# Altium schematic sheet 6_power.SchDoc: Power management
size A4; OrganizationName: Pluton UPV; Address1: Universitat Politècnica; Address2: de València (UPV); Address3: Camí de Vera, València; Address4: Spain; DocumentNumber: 3; Revision: 0; SheetNumber: 6; SheetTotal: 8
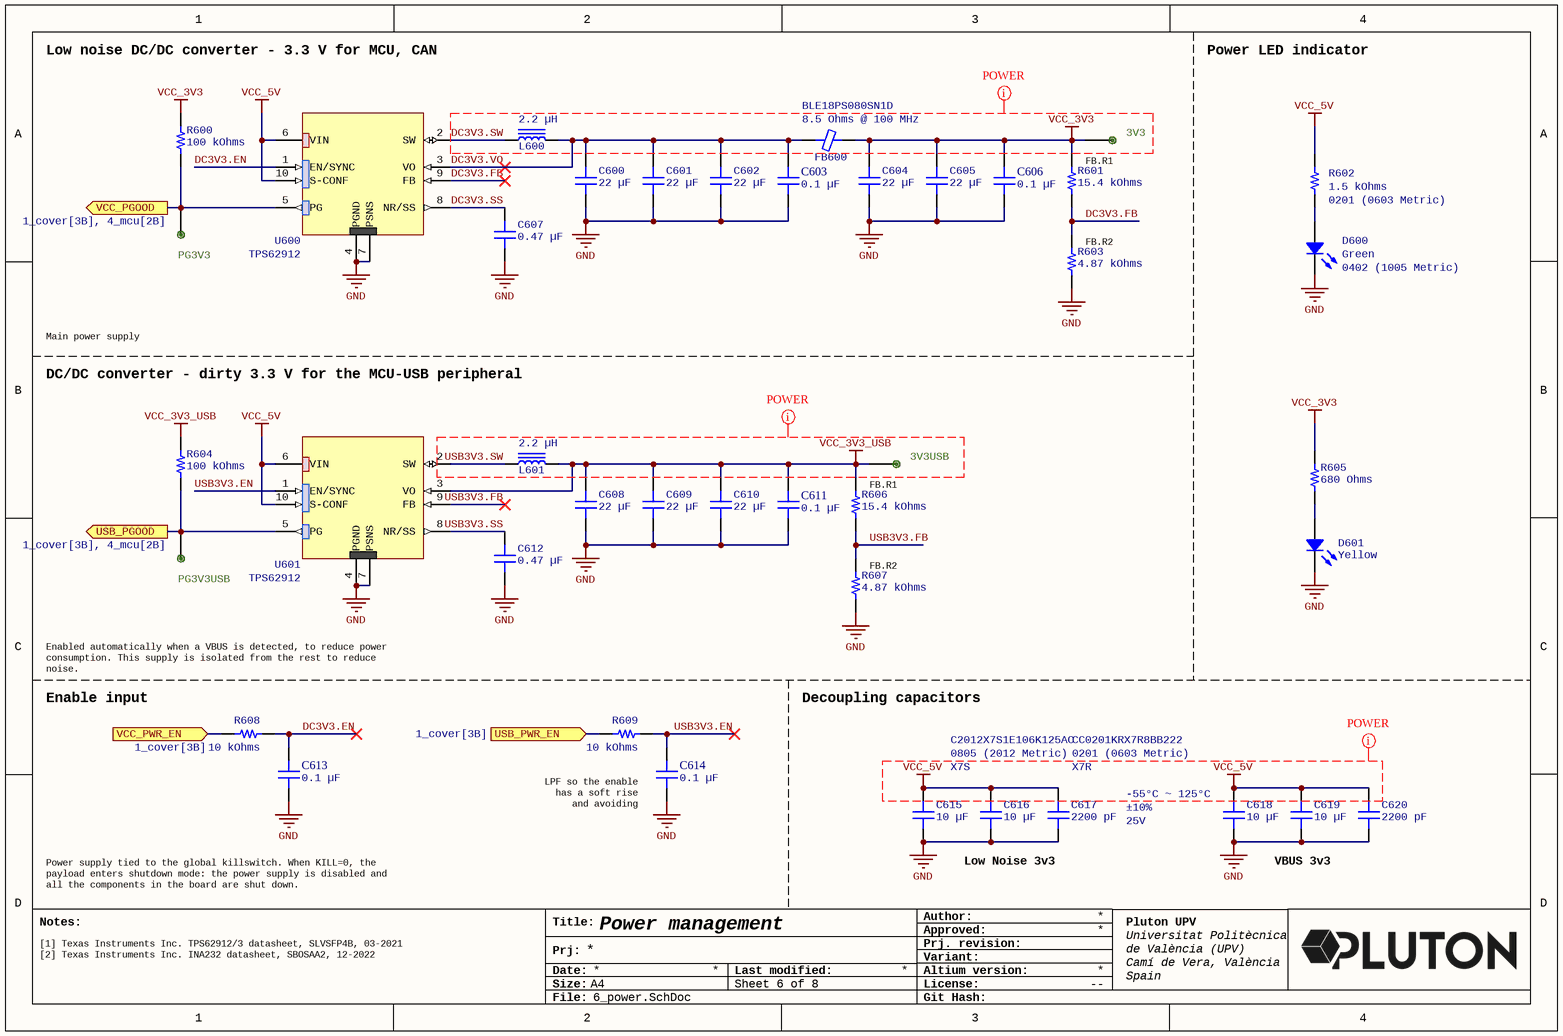
[diagram p0: 6_power.SchDoc]

## Parts
3V3  (no value)  [testpoint_via]  (no BOM)
3V3USB  (no value)  [testpoint_via]  (no BOM)
C600  22 µF  [CAP 0805_2012]
C601  22 µF  [CAP 0805_2012]
C602  22 µF  [CAP 0805_2012]
C603  0.1 µF  [CAP 0402_1005]
C604  22 µF  [CAP 0805_2012]
C605  22 µF  [CAP 0805_2012]
C606  0.1 µF  [CAP 0402_1005]
C607  0.47 µF  [CAP 0402_1005]
C608  22 µF  [CAP 0805_2012]
C609  22 µF  [CAP 0805_2012]
C610  22 µF  [CAP 0805_2012]
C611  0.1 µF  [CAP 0402_1005]
C612  0.47 µF  [CAP 0402_1005]
C613  0.1 µF  [CAP 0402_1005]
C614  0.1 µF  [CAP 0402_1005]
C615  10 µF  [CAP 0805_2012]
C616  Part Number: C2012X7S1E106K125AC  Device Package: 0805 (2012 Metric)  Temperature Coefficient: X7S  [CAP 0805_2012]  (hidden comment: 10 µF)
C617  Part Number: CC0201KRX7R8BB222  Device Package: 0201 (0603 Metric)  Operating Temperature: -55°C ~ 125°C  Temperature Coefficient: X7R  Tolerance: ±10%  Voltage - Rated: 25V  [CAP 0201_0603]  (hidden comment: 2200 pF)
C618  10 µF  [CAP 0805_2012]
C619  10 µF  [CAP 0805_2012]
C620  2200 pF  [CAP 0201_0603]
D600  Device Package: 0402 (1005 Metric)  [LED 0402_1005 GREEN]  (hidden comment: Green)
D601  Yellow  [LED 0402_1005 YELLOW]
FB600  Part Number: BLE18PS080SN1D  [FER 0603_1608]  (hidden comment: 8.5 Ohms @ 100 MHz)
L600  2.2 µH  [BOURNS SRN4018]
L601  2.2 µH  [BOURNS SRN4018]
PG3V3  (no value)  [testpoint_via]  (no BOM)
PG3V3USB  (no value)  [testpoint_via]  (no BOM)
R600  100 kOhms  [RES 0201_0603]
R601  15.4 kOhms  [RES 0201_0603]
R602  Device Package: 0201 (0603 Metric)  [RES 0201_0603]  (hidden comment: 1.5 kOhms)
R603  4.87 kOhms  [RES 0201_0603]
R604  100 kOhms  [RES 0201_0603]
R605  680 Ohms  [RES 0201_0603]
R606  15.4 kOhms  [RES 0201_0603]
R607  4.87 kOhms  [RES 0201_0603]
R608  10 kOhms  [RES 0201_0603]
R609  10 kOhms  [RES 0201_0603]
U600  TPS62912  [VQFN-HR-TPS6291X]
U601  TPS62912  [VQFN-HR-TPS6291X]

## Ports
USB_PGOOD (out, see 1_cover[3B], 4_mcu[2B]), USB_PWR_EN (in, see 1_cover[3B]), VCC_PGOOD (out, see 1_cover[3B], 4_mcu[2B]), VCC_PWR_EN (in, see 1_cover[3B])

## Nets
GND: C600.1 C601.1 C602.1 C603.1 C604.1 C605.1 C606.1 C607.1 C608.1 C609.1 C610.1 C611.1 C612.1 C613.1 C614.1 C615.1 C616.1 C617.1 C618.1 C619.1 C620.1 D600.2 D601.2 R603.1 R607.1 U600.4(PGND) U600.7(PSNS) U601.4(PGND) U601.7(PSNS)
VCC_3V3: 3V3.0 C604.2 C605.2 C606.2 FB600.2 R600.2 R601.2 R605.2
VCC_3V3_USB: 3V3USB.0 C608.2 C609.2 C610.2 C611.2 L601.2 R604.2 R606.2 U601.3(VO)
VCC_5V: C615.2 C616.2 C617.2 C618.2 C619.2 C620.2 R602.2 U600.6(VIN) U600.10(S-CONF) U601.6(VIN) U601.10(S-CONF)
DC3V3.EN: C613.2 R608.1 U600.1(EN/SYNC)
DC3V3.FB: R601.1 R603.2 U600.9(FB)
DC3V3.SS: C607.2 U600.8(NR/SS)
DC3V3.SW: L600.1 U600.2(SW)
DC3V3.VO: C600.2 C601.2 C602.2 C603.2 FB600.1 L600.2 U600.3(VO)
USB3V3.EN: C614.2 R609.1 U601.1(EN/SYNC)
USB3V3.FB: R606.1 R607.2 U601.9(FB)
USB3V3.SS: C612.2 U601.8(NR/SS)
USB3V3.SW: L601.1 U601.2(SW)
USB_PGOOD: PG3V3USB.0 R604.1 U601.5(PG) ; port USB_PGOOD
USB_PWR_EN: R609.2 ; port USB_PWR_EN
VCC_PGOOD: PG3V3.0 R600.1 U600.5(PG) ; port VCC_PGOOD
VCC_PWR_EN: R608.2 ; port VCC_PWR_EN
NetD600_1: D600.1 R602.1
NetD601_1: D601.1 R605.1

## Layout directives
rule Width Constraint [Pref Width = 0.4mm    Min Width = 0.2mm    Max Width = 2mm]; net class POWER: DC3V3.SW, USB3V3.SW, VCC_3V3, VCC_3V3_USB, VCC_5V

## Notes on the sheet
- Low noise DC/DC converter - 3.3 V for MCU, CAN
- Power LED indicator
- FB.R1
- (near R603) FB.R2
- DC/DC converter - dirty 3.3 V for the MCU-USB peripheral
- Main power supply
- (near R607) FB.R2
- Enable input
- Enabled automatically when a VBUS is detected, to reduce power consumption. This supply is isolated from the rest to reduce noise.
- Decoupling capacitors
- LPF so the enable
  has a soft rise
  and avoiding glitches
- Power supply tied to the global killswitch. When KILL=0, the payload enters shutdown mode: the power supply is disabled and all the components in the board are shut down.
- Low Noise 3v3
- (near C619) VBUS 3v3
- [1] Texas Instruments Inc. TPS62912/3 datasheet, SLVSFP4B, 03-2021
  [2] Texas Instruments Inc. INA232 datasheet, SBOSAA2, 12-2022
- Notes:
- Title:
- Author:
- Approved:
- Date:
- Prj:
- Size:
- A4
- Last modified:
- Altium version:
- Variant:
- Prj. revision:
- License:
- --
- File:
- Git Hash:

## Library data of the parts
3V3 3V3USB PG3V3 PG3V3USB = TestPoint-VIA: Test point, thru-hole
C600-C602 C604 C605 C608-C610 = C2012X7S1A226M125AC: CAP CER 22UF 10V X7S 0805; manufacturer: TDK Corporation; Tolerance: ±20%; Part Number: C2012X7S1A226M125AC; Value: 22 µF; Applications: General Purpose; Capacitance: 22 µF; componentlink1description: Datasheet; componentlink1url: https://product.tdk.com/info/en/catalog/datasheets/mlcc_commercial_general_en.pdf?ref_disty=digikey; componentlink2description: DigiKey Link; componentlink2url: https://www.digikey.com/en/products/detail/tdk-corporation/C2012X7S1A226M125AC/3951796; Device Package: 0805 (2012 Metric); Features: Low ESL; lastupdated: 09/02/2024 20:15:52; Lifecycle Status: Active; Minimum Order: 1; Mounting Type: Surface Mount, MLCC; Operating Temperature: -55°C ~ 125°C; Package / Case: 0805 (2012 Metric); packaging: TapeAndReel; partid: 47319; Part Status: Active; price: 0.23; series: C; Size / Dimension: 0.079" L x 0.049" W (2.00mm x 1.25mm); Supplier 1: DigiKey; Supplier Part Number 1: 445-14560-1-ND; Temperature Coefficient: X7S; Thickness (Max): 0.057" (1.45mm); Voltage - Rated: 10V
C603 C606 C611 C613 C614 = C0402C104K4RECAUTO: CAP CER 0402 0.1UF 16V X7R 10%; manufacturer: KEMET; Part Number: C0402C104K4RECAUTO; Value: 0.1 µF; Applications: Automotive, ESD Protection; Capacitance: 0.1 µF; componentlink1description: Datasheet; componentlink1url: https://api.kemet.com/component-edge/download/datasheet/C0402C104K4RECAUTO.pdf; componentlink2description: DigiKey Link; componentlink2url: https://www.digikey.com/en/products/detail/kemet/C0402C104K4RECAUTO/8563695; Device Package: 0402 (1005 Metric); lastupdated: 09/02/2024 20:04:38; Lifecycle Status: Active; Minimum Order: 1; Mounting Type: Surface Mount, MLCC; Operating Temperature: -55°C ~ 125°C; Package / Case: 0402 (1005 Metric); packaging: TapeAndReel; partid: 1731; Part Status: Active; price: 0.01; Ratings: AEC-Q200; series: ESD SMD Auto X7R; Size / Dimension: 0.039" L x 0.020" W (1.00mm x 0.50mm); Supplier 1: DigiKey; Supplier Part Number 1: 399-17167-1-ND; Temperature Coefficient: X7R; Thickness (Max): 0.022" (0.55mm); Tolerance: ±10%; Voltage - Rated: 16V
C607 C612 = CGA2B1X7S1C474K050BC: CAP CER 0.47UF 16V X7S 0402; manufacturer: TDK Corporation; Tolerance: ±10%; Part Number: CGA2B1X7S1C474K050BC; Value: 0.47 µF; Applications: Automotive; Capacitance: 0.47 µF; componentlink1description: Datasheet; componentlink1url: https://product.tdk.com/info/en/catalog/datasheets/mlcc_automotive_general_en.pdf?ref_disty=digikey; componentlink2description: DigiKey Link; componentlink2url: https://www.digikey.com/en/products/detail/tdk-corporation/CGA2B1X7S1C474K050BC/4931442; Device Package: 0402 (1005 Metric); lastupdated: 09/02/2024 20:04:28; Lifecycle Status: Active; Minimum Order: 1; Mounting Type: Surface Mount, MLCC; Operating Temperature: -55°C ~ 125°C; Package / Case: 0402 (1005 Metric); packaging: TapeAndReel; partid: 7602; Part Status: Active; price: 0.03; Ratings: AEC-Q200; series: CGA; Size / Dimension: 0.039" L x 0.020" W (1.00mm x 0.50mm); Supplier 1: DigiKey; Supplier Part Number 1: 445-174214-1-ND; Temperature Coefficient: X7S; Thickness (Max): 0.022" (0.55mm); Voltage - Rated: 16V
C615 C616 C618 C619 = C2012X7S1E106K125AC: CAP CER 10UF 25V X7S 0805; manufacturer: TDK Corporation; Tolerance: ±10%; Value: 10 µF; Applications: General Purpose; Capacitance: 10 µF; componentlink1description: Datasheet; componentlink1url: https://product.tdk.com/en/search/capacitor/ceramic/mlcc/info?part_no=C2012X7S1E106K125AC?ref_disty=digikey; componentlink2description: DigiKey Link; componentlink2url: https://www.digikey.com/en/products/detail/tdk-corporation/C2012X7S1E106K125AC/9991385; Features: Low ESL; lastupdated: 09/02/2024 20:16:06; Lifecycle Status: Active; Minimum Order: 1; Mounting Type: Surface Mount, MLCC; Operating Temperature: -55°C ~ 125°C; Package / Case: 0805 (2012 Metric); packaging: TapeAndReel; partid: 39303; Part Status: Active; price: 0.11; series: C; Size / Dimension: 0.079" L x 0.049" W (2.00mm x 1.25mm); Supplier 1: DigiKey; Supplier Part Number 1: 445-181600-1-ND; Thickness (Max): 0.059" (1.50mm); Voltage - Rated: 25V
  C615 C618 C619: Part Number: C2012X7S1E106K125AC; Device Package: 0805 (2012 Metric); Temperature Coefficient: X7S
C617 = CC0201KRX7R8BB222: CAP CER 2200PF 25V X7R 0201; manufacturer: Yageo; Value: 2200 pF; Applications: General Purpose; Capacitance: 2200 pF; componentlink1description: Datasheet; componentlink1url: https://www.yageo.com/upload/media/product/productsearch/datasheet/mlcc/UPY-GPHC_X7R_6.3V-to-250V_22.pdf; componentlink2description: DigiKey Link; componentlink2url: https://www.digikey.com/en/products/detail/yageo/CC0201KRX7R8BB222/11490225; lastupdated: 04/06/2024 19:00:56; Lifecycle Status: Active; Minimum Order: 1; Mounting Type: Surface Mount, MLCC; Package / Case: 0201 (0603 Metric); packaging: CutTape; partid: 52408; Part Status: Active; price: 0.01; series: CC; Size / Dimension: 0.024" L x 0.012" W (0.60mm x 0.30mm); Supplier 1: DigiKey; Supplier Part Number 1: 13-CC0201KRX7R8BB222CT-ND; Thickness (Max): 0.013" (0.33mm)
C620 = CC0201KRX7R8BB222: CAP CER 2200PF 25V X7R 0201; manufacturer: Yageo; Tolerance: ±10%; Part Number: CC0201KRX7R8BB222; Value: 2200 pF; Applications: General Purpose; Capacitance: 2200 pF; componentlink1description: Datasheet; componentlink1url: https://www.yageo.com/upload/media/product/productsearch/datasheet/mlcc/UPY-GPHC_X7R_6.3V-to-250V_22.pdf; componentlink2description: DigiKey Link; componentlink2url: https://www.digikey.com/en/products/detail/yageo/CC0201KRX7R8BB222/11490225; Device Package: 0201 (0603 Metric); lastupdated: 04/06/2024 19:00:56; Lifecycle Status: Active; Minimum Order: 1; Mounting Type: Surface Mount, MLCC; Operating Temperature: -55°C ~ 125°C; Package / Case: 0201 (0603 Metric); packaging: CutTape; partid: 52408; Part Status: Active; price: 0.01; series: CC; Size / Dimension: 0.024" L x 0.012" W (0.60mm x 0.30mm); Supplier 1: DigiKey; Supplier Part Number 1: 13-CC0201KRX7R8BB222CT-ND; Temperature Coefficient: X7R; Thickness (Max): 0.013" (0.33mm); Voltage - Rated: 25V
D600 = EAST10052GA0: LED GREEN CLEAR 2SMD; Manufacturer: Everlight Electronics Co Ltd; Configuration: Standard; Current - Test: 5mA; Lens Color: Colorless; Lens Size: 1.00mm x 0.50mm; Lens Style: Rectangle with Flat Top; Viewing Angle: 120°; Voltage - Forward (Vf) (Typ): 2.95V; Wavelength - Peak: 518nm; Part Number: EAST10052GA0; Color: Green; ComponentLink1Description: Datasheet; ComponentLink1URL: https://everlightamericas.com/index.php?controller=attachment&id_attachment=3256; ComponentLink2Description: DigiKey Link; ComponentLink2URL: https://www.digikey.com/en/products/detail/everlight-electronics-co-ltd/EAST10052GA0/8510366; Height (Max): 0.25mm; LastUpdated: 03/06/2024 19:58:14; Lens Transparency: Clear; Lifecycle Status: Active; Minimum Order: 1; Mounting Type: Surface Mount; Package / Case: 0402 (1005 Metric); Packaging: TapeAndReel; PartId: 696; Part Status: Active; Price: 0.09; Series: -; Size / Dimension: 1.00mm L x 0.50mm W; Supplier 1: DigiKey; Supplier Part Number 1: 1080-1557-1-ND; Supplier Device Package: 2-SMD; Value: Green
D601 = FHY1105P-TR: LED YELLOW CLEAR 1005 SMD; Manufacturer: Stanley Electric Co; Configuration: Standard; Current - Test: 5mA; Lens Color: Colorless; Lens Size: 1.00mm x 0.50mm; Lens Style: Rectangle with Flat Top; Millicandela Rating: 32mcd; Voltage - Forward (Vf) (Typ): 1.9V; Wavelength - Dominant: 590nm; Wavelength - Peak: 594nm; Part Number: FHY1105P-TR; Color: Yellow; ComponentLink1Description: Datasheet; ComponentLink1URL: http://www.stanley-components.com/php/downloaddatafile.php?rp=0,FHY1105P-TR_e.pdf; ComponentLink2Description: DigiKey Link; ComponentLink2URL: https://www.digikey.com/en/products/detail/stanley-electric-co/FHY1105P-TR/6205303; Device Package: 0402 (1005 Metric); Height (Max): 0.25mm; LastUpdated: 03/06/2024 20:00:47; Lens Transparency: Clear; Lifecycle Status: Active; Minimum Order: 1; Mounting Type: Surface Mount; Package / Case: 0402 (1005 Metric); Packaging: TapeAndReel; PartId: 166; Part Status: Active; Price: 0.05; Series: -; Size / Dimension: 1.00mm L x 0.50mm W; Supplier 1: DigiKey; Supplier Part Number 1: 404-1209-1-ND; Supplier Device Package: 1005; Value: Yellow
FB600 = BLE18PS080SN1D: FERRITE BEAD 8.5 OHM 0603 1LN; Manufacturer: Murata Electronics; Current Rating (Max): 8A; DC Resistance (DCR) (Max): 4mOhm; Filter Type: Power Line; Number of Lines: 1; ComponentLink1Description: Datasheet; ComponentLink1URL: https://www.murata.com/products/productdata/8800169525278/ENFA0080.pdf; ComponentLink2Description: DigiKey Link; ComponentLink2URL: https://www.digikey.com/en/products/detail/murata-electronics/BLE18PS080SN1D/13904803; Device Package: 0603 (1608 Metric); Height (Max): 0.030" (0.75mm); Impedance @ Frequency: 8.5 Ohms @ 100 MHz; LastUpdated: 03/06/2024 19:51:46; Lifecycle Status: Active; Minimum Order: 1; Mounting Type: Surface Mount; Operating Temperature: -55°C ~ 125°C; Package / Case: 0603 (1608 Metric); Packaging: TapeAndReel; PartId: 2651; Part Status: Active; Price: 0.08; Series: EMIFIL®, BLE18; Size / Dimension: 0.063" L x 0.031" W (1.60mm x 0.80mm); Supplier 1: DigiKey; Supplier Part Number 1: 490-BLE18PS080SN1DCT-ND; Value: 8.5 Ohms @ 100 MHz
L600 L601 = SRN4018-2R2M: FIXED IND 2.2UH 2.9A 44 MOHM SMD; Manufacturer: Bourns Inc.; Current - Saturation: 3A; DC Resistance (DCR): 44mOhm Max; Frequency - Self Resonant: 60MHz; Inductance Frequency - Test: 100 kHz; Material - Core: Ferrite; Q @ Freq: 9 @ 7.96MHz; Shielding: Shielded; Tolerance: ±20%; Type: Drum Core, Wirewound; Part Number: SRN4018-2R2M; ComponentLink1Description: Datasheet; ComponentLink1URL: https://www.bourns.com/docs/Product-Datasheets/SRN4018.pdf; ComponentLink2Description: DigiKey Link; ComponentLink2URL: https://www.digikey.com/en/products/detail/bourns-inc/SRN4018-2R2M/3821619; Current Rating (Amps): 2.9 A; Device Package: Nonstandard; Height - Seated (Max): 0.071" (1.80mm); Inductance: 2.2 µH; LastUpdated: 03/06/2024 20:24:37; Lifecycle Status: Active; Minimum Order: 1; Mounting Type: Surface Mount; Operating Temperature: -40°C ~ 125°C; Package / Case: Nonstandard; Packaging: TapeAndReel; PartId: 3660; Part Status: Active; Price: 0.17; Series: SRN4018; Size / Dimension: 0.157" L x 0.157" W (4.00mm x 4.00mm); Supplier 1: DigiKey; Supplier Part Number 1: SRN4018-2R2MCT-ND; Value: 2.2 µH
R600 R604 = RC0201FR-13100KL: RES 100K OHM 1% 1/20W 0201; Manufacturer: Yageo; Power (Watts): 0.05W, 1/20W; Temperature Coefficient: ±200ppm/°C; Part Number: RC0201FR-13100KL; Value: 100 kOhms; ComponentLink1Description: Datasheet; ComponentLink1URL: https://www.yageo.com/upload/media/product/productsearch/datasheet/rchip/PYu-RC_Group_51_RoHS_L_12.pdf; ComponentLink2Description: DigiKey Link; ComponentLink2URL: https://www.digikey.com/en/products/detail/yageo/RC0201FR-13100KL/17014509; Composition: Thick Film; Device Package: 0201 (0603 Metric); Features: Moisture Resistant; Height - Seated (Max): 0.010" (0.26mm); LastUpdated: 04/06/2024 19:11:47; Lifecycle Status: Active; Minimum Order: 1; Number of Terminations: 2; Operating Temperature: -55°C ~ 125°C; Package / Case: 0201 (0603 Metric); Packaging: CutTape; PartId: 80199; Price: 0.01; Resistance: 100 kOhms; Series: RC_L; Size / Dimension: 0.024" L x 0.012" W (0.60mm x 0.30mm); Supplier 1: DigiKey; Supplier Part Number 1: 13-RC0201FR-13100KLCT-ND; Supplier Device Package: 0201; Tolerance: ±1%
R601 R606 = RC0201FR-0715K4L: RES 15.4K OHM 1% 1/20W 0201; Manufacturer: Yageo; Power (Watts): 0.05W, 1/20W; Temperature Coefficient: ±200ppm/°C; Part Number: RC0201FR-0715K4L; Value: 15.4 kOhms; ComponentLink1Description: Datasheet; ComponentLink1URL: https://www.yageo.com/upload/media/product/productsearch/datasheet/rchip/PYu-RC_Group_51_RoHS_L_10.pdf; ComponentLink2Description: DigiKey Link; ComponentLink2URL: https://www.digikey.com/en/products/detail/yageo/RC0201FR-0715K4L/5280281; Composition: Thick Film; Device Package: 0201 (0603 Metric); Features: Moisture Resistant; Height - Seated (Max): 0.010" (0.26mm); LastUpdated: 04/06/2024 19:12:00; Lifecycle Status: Active; Minimum Order: 1; Number of Terminations: 2; Operating Temperature: -55°C ~ 125°C; Package / Case: 0201 (0603 Metric); Packaging: TapeAndReel; PartId: 714; Part Status: Active; Price: 0.01; Resistance: 15.4 kOhms; Series: RC_L; Size / Dimension: 0.024" L x 0.012" W (0.60mm x 0.30mm); Supplier 1: DigiKey; Supplier Part Number 1: YAG2421CT-ND; Supplier Device Package: 0201; Tolerance: ±1%
R602 = CRCW02011K50JNED: RES SMD 1.5K OHM 5% 1/20W 0201; Manufacturer: Vishay Dale; Power (Watts): 0.05W, 1/20W; Temperature Coefficient: ±200ppm/°C; Part Number: CRCW02011K50JNED; Value: 1.5 kOhms; ComponentLink1Description: Datasheet; ComponentLink1URL: http://www.vishay.com/docs/20052/crcw0201e3.pdf; ComponentLink2Description: DigiKey Link; ComponentLink2URL: http://digikey.com/product-detail/en/vishay-dale/CRCW02011K50JNED/541-CRCW02011K50JNEDCT-ND/10449419; Composition: Thick Film; Height - Seated (Max): 0.011" (0.28mm); LastUpdated: 04/06/2024 19:12:01; Lifecycle Status: Active; Minimum Order: 1; Number of Terminations: 2; Operating Temperature: -55°C ~ 155°C; Package / Case: 0201 (0603 Metric); Packaging: CutTape; PartId: 491; Part Status: Active; Price: 0.10; Resistance: 1.5 kOhms; Series: CRCW; Size / Dimension: 0.024" L x 0.012" W (0.60mm x 0.30mm); Supplier 1: DigiKey; Supplier Part Number 1: 541-CRCW02011K50JNEDCT-ND; Supplier Device Package: 0201; Tolerance: ±5%
R603 R607 = RC0201FR-074K87L: RES 4.87K OHM 1% 1/20W 0201; Manufacturer: Yageo; Power (Watts): 0.05W, 1/20W; Temperature Coefficient: ±200ppm/°C; Part Number: RC0201FR-074K87L; Value: 4.87 kOhms; ComponentLink1Description: Datasheet; ComponentLink1URL: https://www.yageo.com/upload/media/product/productsearch/datasheet/rchip/PYu-RC_Group_51_RoHS_L_10.pdf; ComponentLink2Description: DigiKey Link; ComponentLink2URL: https://www.digikey.com/en/products/detail/yageo/RC0201FR-074K87L/5280571; Composition: Thick Film; Device Package: 0201 (0603 Metric); Features: Moisture Resistant; Height - Seated (Max): 0.010" (0.26mm); LastUpdated: 04/06/2024 19:11:58; Lifecycle Status: Active; Minimum Order: 1; Number of Terminations: 2; Operating Temperature: -55°C ~ 125°C; Package / Case: 0201 (0603 Metric); Packaging: TapeAndReel; PartId: 1350; Part Status: Active; Price: 0.01; Resistance: 4.87 kOhms; Series: RC_L; Size / Dimension: 0.024" L x 0.012" W (0.60mm x 0.30mm); Supplier 1: DigiKey; Supplier Part Number 1: YAG2711CT-ND; Supplier Device Package: 0201; Tolerance: ±1%
R605 = RC0201JR-07680RL: RES 680 OHM 5% 1/20W 0201; Manufacturer: Yageo; Power (Watts): 0.05W, 1/20W; Temperature Coefficient: ±200ppm/°C; Part Number: RC0201JR-07680RL; Value: 680 Ohms; ComponentLink1Description: Datasheet; ComponentLink1URL: https://www.yageo.com/upload/media/product/productsearch/datasheet/rchip/PYu-RC_Group_51_RoHS_L_10.pdf; ComponentLink2Description: DigiKey Link; ComponentLink2URL: https://www.digikey.com/en/products/detail/yageo/RC0201JR-07680RL/1948962; Composition: Thick Film; Device Package: 0201 (0603 Metric); Features: Moisture Resistant; Height - Seated (Max): 0.010" (0.26mm); LastUpdated: 04/06/2024 19:12:00; Lifecycle Status: Active; Minimum Order: 1; Number of Terminations: 2; Operating Temperature: -55°C ~ 125°C; Package / Case: 0201 (0603 Metric); Packaging: CutTape; PartId: 715; Part Status: Active; Price: 0.01; Resistance: 680 Ohms; Series: RC_L; Size / Dimension: 0.024" L x 0.012" W (0.60mm x 0.30mm); Supplier 1: DigiKey; Supplier Part Number 1: 311-680NCT-ND; Supplier Device Package: 0201; Tolerance: ±5%
R608 R609 = AF0201FR-0710KL: RES SMD 10K OHM 1% 1/20W 0201; Manufacturer: Yageo; Power (Watts): 0.05W, 1/20W; Temperature Coefficient: ±200ppm/°C; Part Number: AF0201FR-0710KL; Value: 10 kOhms; ComponentLink1Description: Datasheet; ComponentLink1URL: https://www.yageo.com/upload/media/product/productsearch/datasheet/rchip/PYu-AF_51_RoHS_L_9.pdf; ComponentLink2Description: DigiKey Link; ComponentLink2URL: https://www.digikey.com/en/products/detail/yageo/AF0201FR-0710KL/5900138; Composition: Thick Film; Device Package: 0201 (0603 Metric); Features: Anti-Sulfur, Automotive AEC-Q200; Height - Seated (Max): 0.010" (0.26mm); LastUpdated: 04/06/2024 19:11:47; Lifecycle Status: Active; Minimum Order: 1; Number of Terminations: 2; Operating Temperature: -55°C ~ 125°C; Package / Case: 0201 (0603 Metric); Packaging: TapeAndReel; PartId: 78061; Part Status: Active; Price: 0.01; Ratings: AEC-Q200; Resistance: 10 kOhms; Series: AF; Size / Dimension: 0.024" L x 0.012" W (0.60mm x 0.30mm); Supplier 1: DigiKey; Supplier Part Number 1: 13-AF0201FR-0710KLCT-ND; Supplier Device Package: 0201; Tolerance: ±1%
U600 U601 = TPS62912: 3-V to 17-V, 2-A/3-A Low Noise and Low Ripple Buck Converter with Integrated Ferrite Bead Filter Compensation